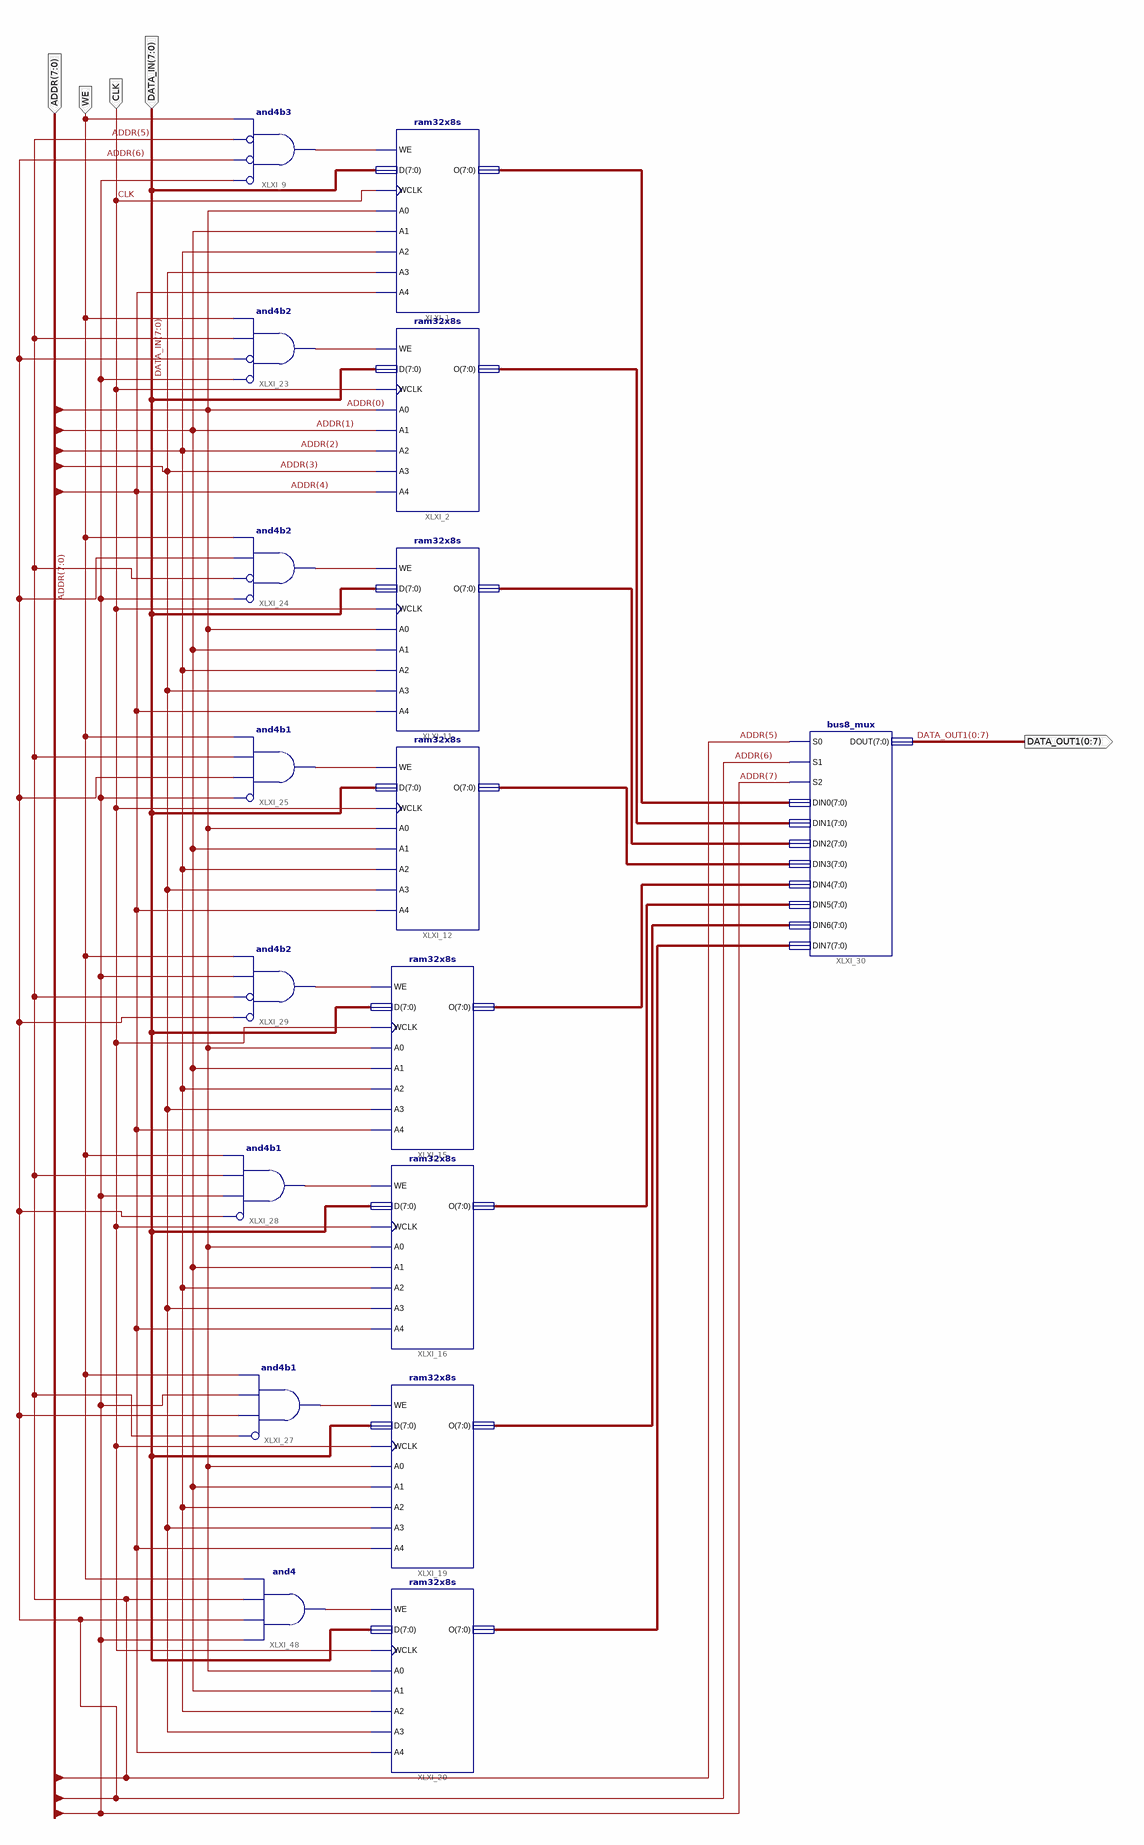
[diagram p0: schematic sheet 1]
// Xilinx ISE schematic RAM_array.sch (spartan3e) as structural Verilog: 17 symbols, 5 ports
module RAM_array (
  input  [7:0] ADDR,
  input  [7:0] DATA_IN,
  input  WE,
  input  CLK,
  output [0:7] DATA_OUT1
);

  wire XLXN_1, XLXN_2, XLXN_3, XLXN_4, XLXN_8, XLXN_10, XLXN_11, XLXN_12;
  wire [7:0] XLXN_13, XLXN_14, XLXN_15, XLXN_16, XLXN_17, XLXN_18, XLXN_19, XLXN_20;

  and XLXI_29 (XLXN_10, ~ADDR[6], ~ADDR[5], ADDR[7], WE);  // and4b2
  bus8_mux XLXI_30 (
    .DIN0(XLXN_13), .DIN1(XLXN_14), .DIN2(XLXN_15), .DIN3(XLXN_16), .DIN4(XLXN_17), .DIN5(XLXN_18),
    .DIN6(XLXN_19), .DIN7(XLXN_20), .DOUT(DATA_OUT1), .S0(ADDR[5]), .S1(ADDR[6]), .S2(ADDR[7]));
  and XLXI_28 (XLXN_11, ~ADDR[6], ADDR[7], ADDR[5], WE);  // and4b1
  and XLXI_27 (XLXN_12, ~ADDR[5], ADDR[6], ADDR[7], WE);  // and4b1
  and XLXI_25 (XLXN_4, ~ADDR[7], ADDR[6], ADDR[5], WE);  // and4b1
  and XLXI_24 (XLXN_3, ~ADDR[7], ~ADDR[5], ADDR[6], WE);  // and4b2
  and XLXI_23 (XLXN_2, ~ADDR[7], ~ADDR[6], ADDR[5], WE);  // and4b2
  ram32x8s XLXI_20 (
    .A0(ADDR[0]), .A1(ADDR[1]), .A2(ADDR[2]), .A3(ADDR[3]), .A4(ADDR[4]), .D(DATA_IN), .WCLK(CLK),
    .WE(XLXN_8), .O(XLXN_20));
  ram32x8s XLXI_19 (
    .A0(ADDR[0]), .A1(ADDR[1]), .A2(ADDR[2]), .A3(ADDR[3]), .A4(ADDR[4]), .D(DATA_IN), .WCLK(CLK),
    .WE(XLXN_12), .O(XLXN_19));
  ram32x8s XLXI_16 (
    .A0(ADDR[0]), .A1(ADDR[1]), .A2(ADDR[2]), .A3(ADDR[3]), .A4(ADDR[4]), .D(DATA_IN), .WCLK(CLK),
    .WE(XLXN_11), .O(XLXN_18));
  ram32x8s XLXI_15 (
    .A0(ADDR[0]), .A1(ADDR[1]), .A2(ADDR[2]), .A3(ADDR[3]), .A4(ADDR[4]), .D(DATA_IN), .WCLK(CLK),
    .WE(XLXN_10), .O(XLXN_17));
  ram32x8s XLXI_12 (
    .A0(ADDR[0]), .A1(ADDR[1]), .A2(ADDR[2]), .A3(ADDR[3]), .A4(ADDR[4]), .D(DATA_IN), .WCLK(CLK),
    .WE(XLXN_4), .O(XLXN_16));
  ram32x8s XLXI_11 (
    .A0(ADDR[0]), .A1(ADDR[1]), .A2(ADDR[2]), .A3(ADDR[3]), .A4(ADDR[4]), .D(DATA_IN), .WCLK(CLK),
    .WE(XLXN_3), .O(XLXN_15));
  and XLXI_9 (XLXN_1, ~ADDR[7], ~ADDR[6], ~ADDR[5], WE);  // and4b3
  ram32x8s XLXI_2 (
    .A0(ADDR[0]), .A1(ADDR[1]), .A2(ADDR[2]), .A3(ADDR[3]), .A4(ADDR[4]), .D(DATA_IN), .WCLK(CLK),
    .WE(XLXN_2), .O(XLXN_14));
  ram32x8s XLXI_1 (
    .A0(ADDR[0]), .A1(ADDR[1]), .A2(ADDR[2]), .A3(ADDR[3]), .A4(ADDR[4]), .D(DATA_IN), .WCLK(CLK),
    .WE(XLXN_1), .O(XLXN_13));
  and XLXI_48 (XLXN_8, ADDR[7], ADDR[6], ADDR[5], WE);
endmodule
